# Altium schematic sheet HS1-HS2_audio.SchDoc
size A
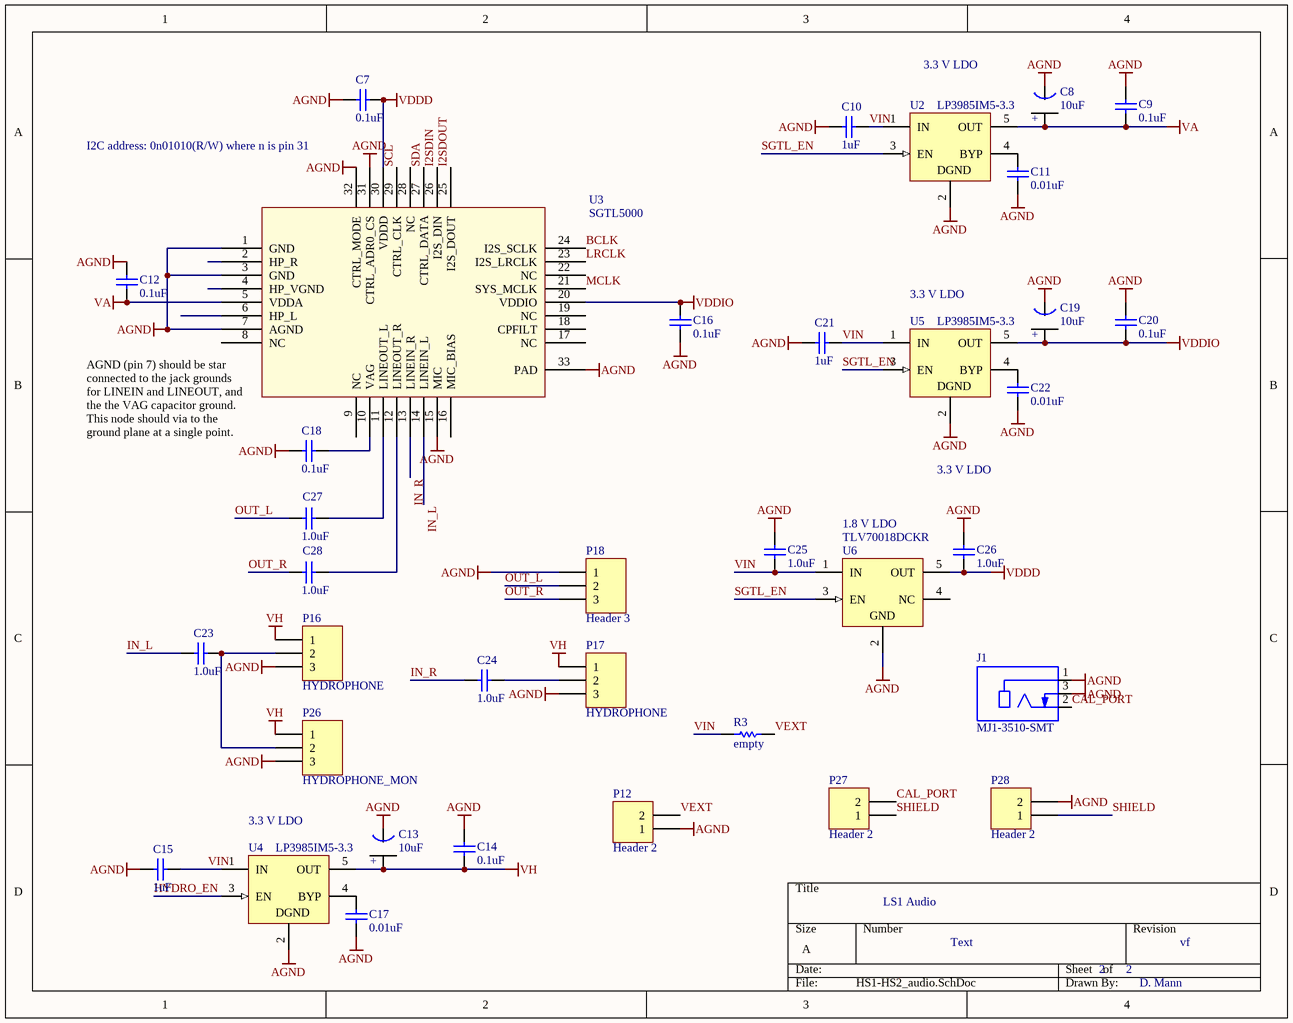
[diagram p0: HS1-HS2_audio.SchDoc]

## Parts
C7  0.1uF  [0402]
C8  10uF  [Tant0805]
C9  0.1uF  [0402]
C10  1uF  [0402]
C11  0.01uF  [0402]
C12  0.1uF  [0402]
C13  10uF  [Tant0805]
C14  0.1uF  [0402]
C15  1uF  [0402]
C16  0.1uF  [0402]
C17  0.01uF  [0402]
C18  0.1uF  [0402]
C19  10uF  [Tant0805]
C20  0.1uF  [0402]
C21  1uF  [0402]
C22  0.01uF  [0402]
C23  1.0uF  [0402]
C24  1.0uF  [0402]
C25  1.0uF  [0402]
C26  1.0uF  [0402]
C27  1.0uF  [0402]
C28  1.0uF  [0402]
J1  MJ1-3510-SMT  [CUI_MJ1-3510-SMT]
P12  Header 2  [HDR1X2]
P16  HYDROPHONE  [HDR1X3]
P17  HYDROPHONE  [HDR1X3]
P18  Header 3  [HDR1X3]
P26  HYDROPHONE_MON  [HDR1X3]
P27  Header 2  [HDR1X2]
P28  Header 2  [HDR1X2]
R3  empty  [3-0603]
U2  LP3985IM5-3.3  [MF05A_N]
U3  SGTL5000  [QFN32]
U4  LP3985IM5-3.3  [MF05A_N]
U5  LP3985IM5-3.3  [MF05A_N]
U6  TLV70018DCKR  [TI-DCK5_V]

## Nets
AGND: C7.2 C8.1(GND) C9.2 C10.2 C11.2 C12.2 C13.1(GND) C14.2 C15.2 C16.2 C17.2 C18.2 C19.1(GND) C20.2 C21.2 C22.2 C25.2 C26.2 J1.1 J1.3 P12.1 P16.3 P17.3 P18.1 P26.3 P28.2 U2.2(GND) U3.1(GND) U3.3(GND) U3.7(AGND) U3.15(MIC) U3.31(CTRL_ADR0_CS) U3.32(CTRL_MODE) U3.33(PAD) U4.2(GND) U5.2(GND) U6.2(GND)
VA: C8.2(+) C9.1 C12.1 U2.5(OUT) U3.5(VDDA)
VDDD: C7.1 C26.1 U3.30(VDDD) U6.5(OUT)
VDDIO: C16.1 C19.2(+) C20.1 U3.20(VDDIO) U5.5(OUT)
VH: C13.2(+) C14.1 P16.1 P17.1 P26.1 U4.5(OUT)
BCLK: U3.24(I2S_SCLK)
CAL_PORT: J1.2 P27.2
HYDRO_EN: U4.3(EN)
I2SDIN: U3.26(I2S_DIN)
I2SDOUT: U3.25(I2S_DOUT)
IN_L: C23.2 U3.14(LINEIN_L)
IN_R: C24.2 U3.13(LINEIN_R)
LRCLK: U3.23(I2S_LRCLK)
MCLK: U3.21(SYS_MCLK)
OUT_L: C27.1 P18.2
OUT_R: C28.1 P18.3
SCL: U3.29(CTRL_CLK)
SDA: U3.27(CTRL_DATA)
SGTL_EN: U2.3(EN) U5.3(EN) U6.3(EN)
SHIELD: P27.1 P28.1
VEXT: P12.2 R3.1
VIN: C10.1 C15.1 C21.1 C25.1 R3.2 U2.1(IN) U4.1(IN) U5.1(IN) U6.1(IN)
NetC11_1: C11.1 U2.4(BYP)
NetC17_1: C17.1 U4.4(BYP)
NetC18_1: C18.1 U3.10(VAG)
NetC22_1: C22.1 U5.4(BYP)
NetC23_1: C23.1 P16.2 P26.2
NetC24_1: C24.1 P17.2
NetC27_2: C27.2 U3.11(LINEOUT_L)
NetC28_2: C28.2 U3.12(LINEOUT_R)

Not connected (* = marked no-connect by the designer): U3 2(HP_R) 4(HP_VGND) 6(HP_L) 8(NC) 9(NC) 16(MIC_BIAS) 17(NC) 18(CPFILT) 19(NC) 22(NC) 28(NC); U6 4(NC)

## Notes on the sheet
- 3.3 V LDO
- I2C address: 0n01010(R/W) where n is pin 31
- (near U5) 3.3 V LDO
- (near U3) AGND (pin 7) should be star connected to the jack grounds for LINEIN and LINEOUT, and the the VAG capacitor ground. This node should via to the ground plane at a single point.
- (near U6) 1.8 V LDO
- LS1 Audio
- Text
- 2
- vf
- D. Mann
- (in symbol LP3985IM5-3.3) DGND

## Library data of the parts
C7 C9 C12 C14 C16 C18 C20 = C0402: Ceramic Chip Capacitor - Standard; Note: Footprint corresponds to dimensions for bulk cassette packaging. This case size has tightened tolerances.; Published: 17-Jul-2002; LatestRevisionDate: 19-Mar-2004; LatestRevisionNote: Silkscreen size reduced.; DatasheetDocument: Mar-2001; PackageDocument: Mar-2001; PackageReference: 0402; Publisher: Altium Limited; Code_JEITA: 0402; Code_IPC: 1005 [0402]; ComponentLink1Description: Manufacturer Link; ComponentLink1URL: http://www.kemet.com/; ComponentLink2Description: Datasheet; ComponentLink2URL: http://www.kemet.com/kemet/web/homepage/kechome.nsf/vapubfilesname/F3102TA.pdf/$file/F3102TA.pdf; Value: 0.1uF
C8 C13 C19 = Tant0805: Value: 10uF
C10 C11 C15 C17 C21-C28 = C0402: Ceramic Chip Capacitor - Standard; Note: Footprint corresponds to dimensions for bulk cassette packaging. This case size has tightened tolerances.; Value: 0.1uF; Published: 17-Jul-2002; LatestRevisionDate: 19-Mar-2004; LatestRevisionNote: Silkscreen size reduced.; DatasheetDocument: Mar-2001; PackageDocument: Mar-2001; PackageReference: 0402; Publisher: Altium Limited; Code_JEITA: 0402; Code_IPC: 1005 [0402]; ComponentLink1Description: Manufacturer Link; ComponentLink1URL: http://www.kemet.com/; ComponentLink2Description: Datasheet; ComponentLink2URL: http://www.kemet.com/kemet/web/homepage/kechome.nsf/vapubfilesname/F3102TA.pdf/$file/F3102TA.pdf
J1 = MJ1-3510-SMT: 3.5 mm, Mono, Right Angle, Surface Mount (SMT), Audio Jack Connector; MF: {'manufacturer': u'CUI'}; Value: *; Price: None; Availability: Unavailable; Package: None; MP: MJ1-3510-SMT
P12 P27 P28 = Header 2: Header, 2-Pin; LatestRevisionDate: 17-Jul-2002; LatestRevisionNote: Re-released for DXP Platform.; Publisher: Altium Limited
P16-P18 P26 = Header 3: Header, 3-Pin; LatestRevisionDate: 17-Jul-2002; LatestRevisionNote: Re-released for DXP Platform.; Publisher: Altium Limited
R3 = ERJ3RK: Precision Thick Film Chip Resistor, 10 Ohm to 1M Ohm Range, 1% and 0.5% Tolerance, 0603 Size, 0.063 W; Published: 17-Dec-2003; LatestRevisionDate: 19-Mar-2004; LatestRevisionNote: Silkscreen size reduced.; PackageDocument: Mar-2003; PackageReference: 3-0603; Publisher: Altium Limited; Code_IPC: 1608 [0603]; ComponentLink1Description: Manufacturer Link; ComponentLink1URL: http://www.panasonic.com/industrial/components/resistive_products.htm; ComponentLink2Description: Datasheet; ComponentLink2URL: http://www.panasonic.com/industrial/components/pdf/AOA0000CE2.pdf
U2 U4 U5 = LP3985IM5-3.3: Micropower, 150mA Low-Noise Ultra Low-Dropout CMOS Voltage Regulator; Manufacturer: National Semiconductor; CompType: LDO IC; PackageTopMarking: LDQB*XTT; PowerWise: N; Published: 4-Dec-2008; DatasheetVersion: Aug-2005; PackageVersion: revD, Aug-2008; PackageReference: MF05A; Publisher: Altium Limited; PackageDescription: Molded SOT-23, .115 x .063 x .040 in Body, 5 Lead, .0375 in Pitch; PartNumber: LP3985IM5-3.3; RoHS: O; PinCount: 5; DigiKeyPartNumber: LP3985IM5-3.3CT-ND; ComponentLink1Description: LP3985 Datasheet; ComponentLink1URL: http://www.national.com/ds/LP/LP3985.pdf; ComponentLink2Description: LP3985 Web Page; ComponentLink2URL: http://www.national.com/pf/LP/LP3985.html; ComponentLink3Description: MF05A Package Page; ComponentLink3URL: http://www.national.com/packaging/folders/mf05a.html
U6 = TLV70018DCKR: Single Output LDO, 200 mA, Fixed 1.8 V Output, 2 to 5.5 V Input, with Low IQ, 5-pin SC70 (DCK), -40 to 125 degC, Green (RoHS & no Sb/Br); Manufacturer: Texas Instruments; Accuracy(%): 2; Fixed Output Options(V): 1.8; Iout(Max)(A): 0.2; Iq(Typ)(mA): 0.03; SubFamily: Single Channel LDO; Vdo(Typ)(mV): 175; Vin(Max)(V): 5.5; DatasheetVersion: SLVSA00D; PackageVersion: 4093553-3/G; PackageReference: DCK5; PackageDescription: 5-Pin Plastic Small-Outline, Body 2 x 1.25 mm, Pitch 0.65 mm; Supplier 1: Digi-Key; Supplier Part Number 1: 296-32409-2-ND; Supplier 2: Digi-Key; Supplier Part Number 2: 296-32409-1-ND; Supplier 3: Digi-Key; Supplier Part Number 3: 296-32409-6-ND; Supplier 4: Newark; Supplier Part Number 4: 55R7461; Supplier 5: Mouser; Supplier Part Number 5: 595-TLV70018DCKR; Eco-Plan: Green (RoHS & no Sb/Br); Vin(Min)(V): 2; Vout Adj(Max)(V): 1.8; Vout Adj(Min)(V): 1.8; Mounting Technology: Surface Mount; Code_JEDEC: MO-203; PartNumber: TLV70018DCKR; ComponentLink1Description: Manufacturer URL; ComponentLink1URL: http://www.ti.com/; ComponentLink2Description: Datasheet; ComponentLink2URL: http://www.ti.com/general/docs/lit/getliterature.tsp?genericPartNumber=TLV70018&fileType=pdf; ComponentLink3Description: Package Specification; ComponentLink3URL: http://www.ti.com/litv/pdf/mpds025f